# Altium schematic sheet Kasli-SOC_bank502_DDR.SchDoc: PS Bank 502
size 420 x 297 mm; CheckedBy: G.Kasprowicz; Author: F.Switakowski; CompanyName: WUT ISE; DrawnBy: F.Switakowski; Organization: WUT ISE; Address1: PW ISE; Address2: Nowowiejska 15/19 00-665 Warsaw; Address3: gkasprow@gmail.com; DocumentNumber: 4; Revision: 1; SheetNumber: 4; SheetTotal: 18; ModifiedBy: -; CheckedDate: -; Title2: DDR SDRAM; DivGrp: WUT ISE; Designer: G.Kasprowicz; ModifiedDate: -; ProjectName: Sensor Box
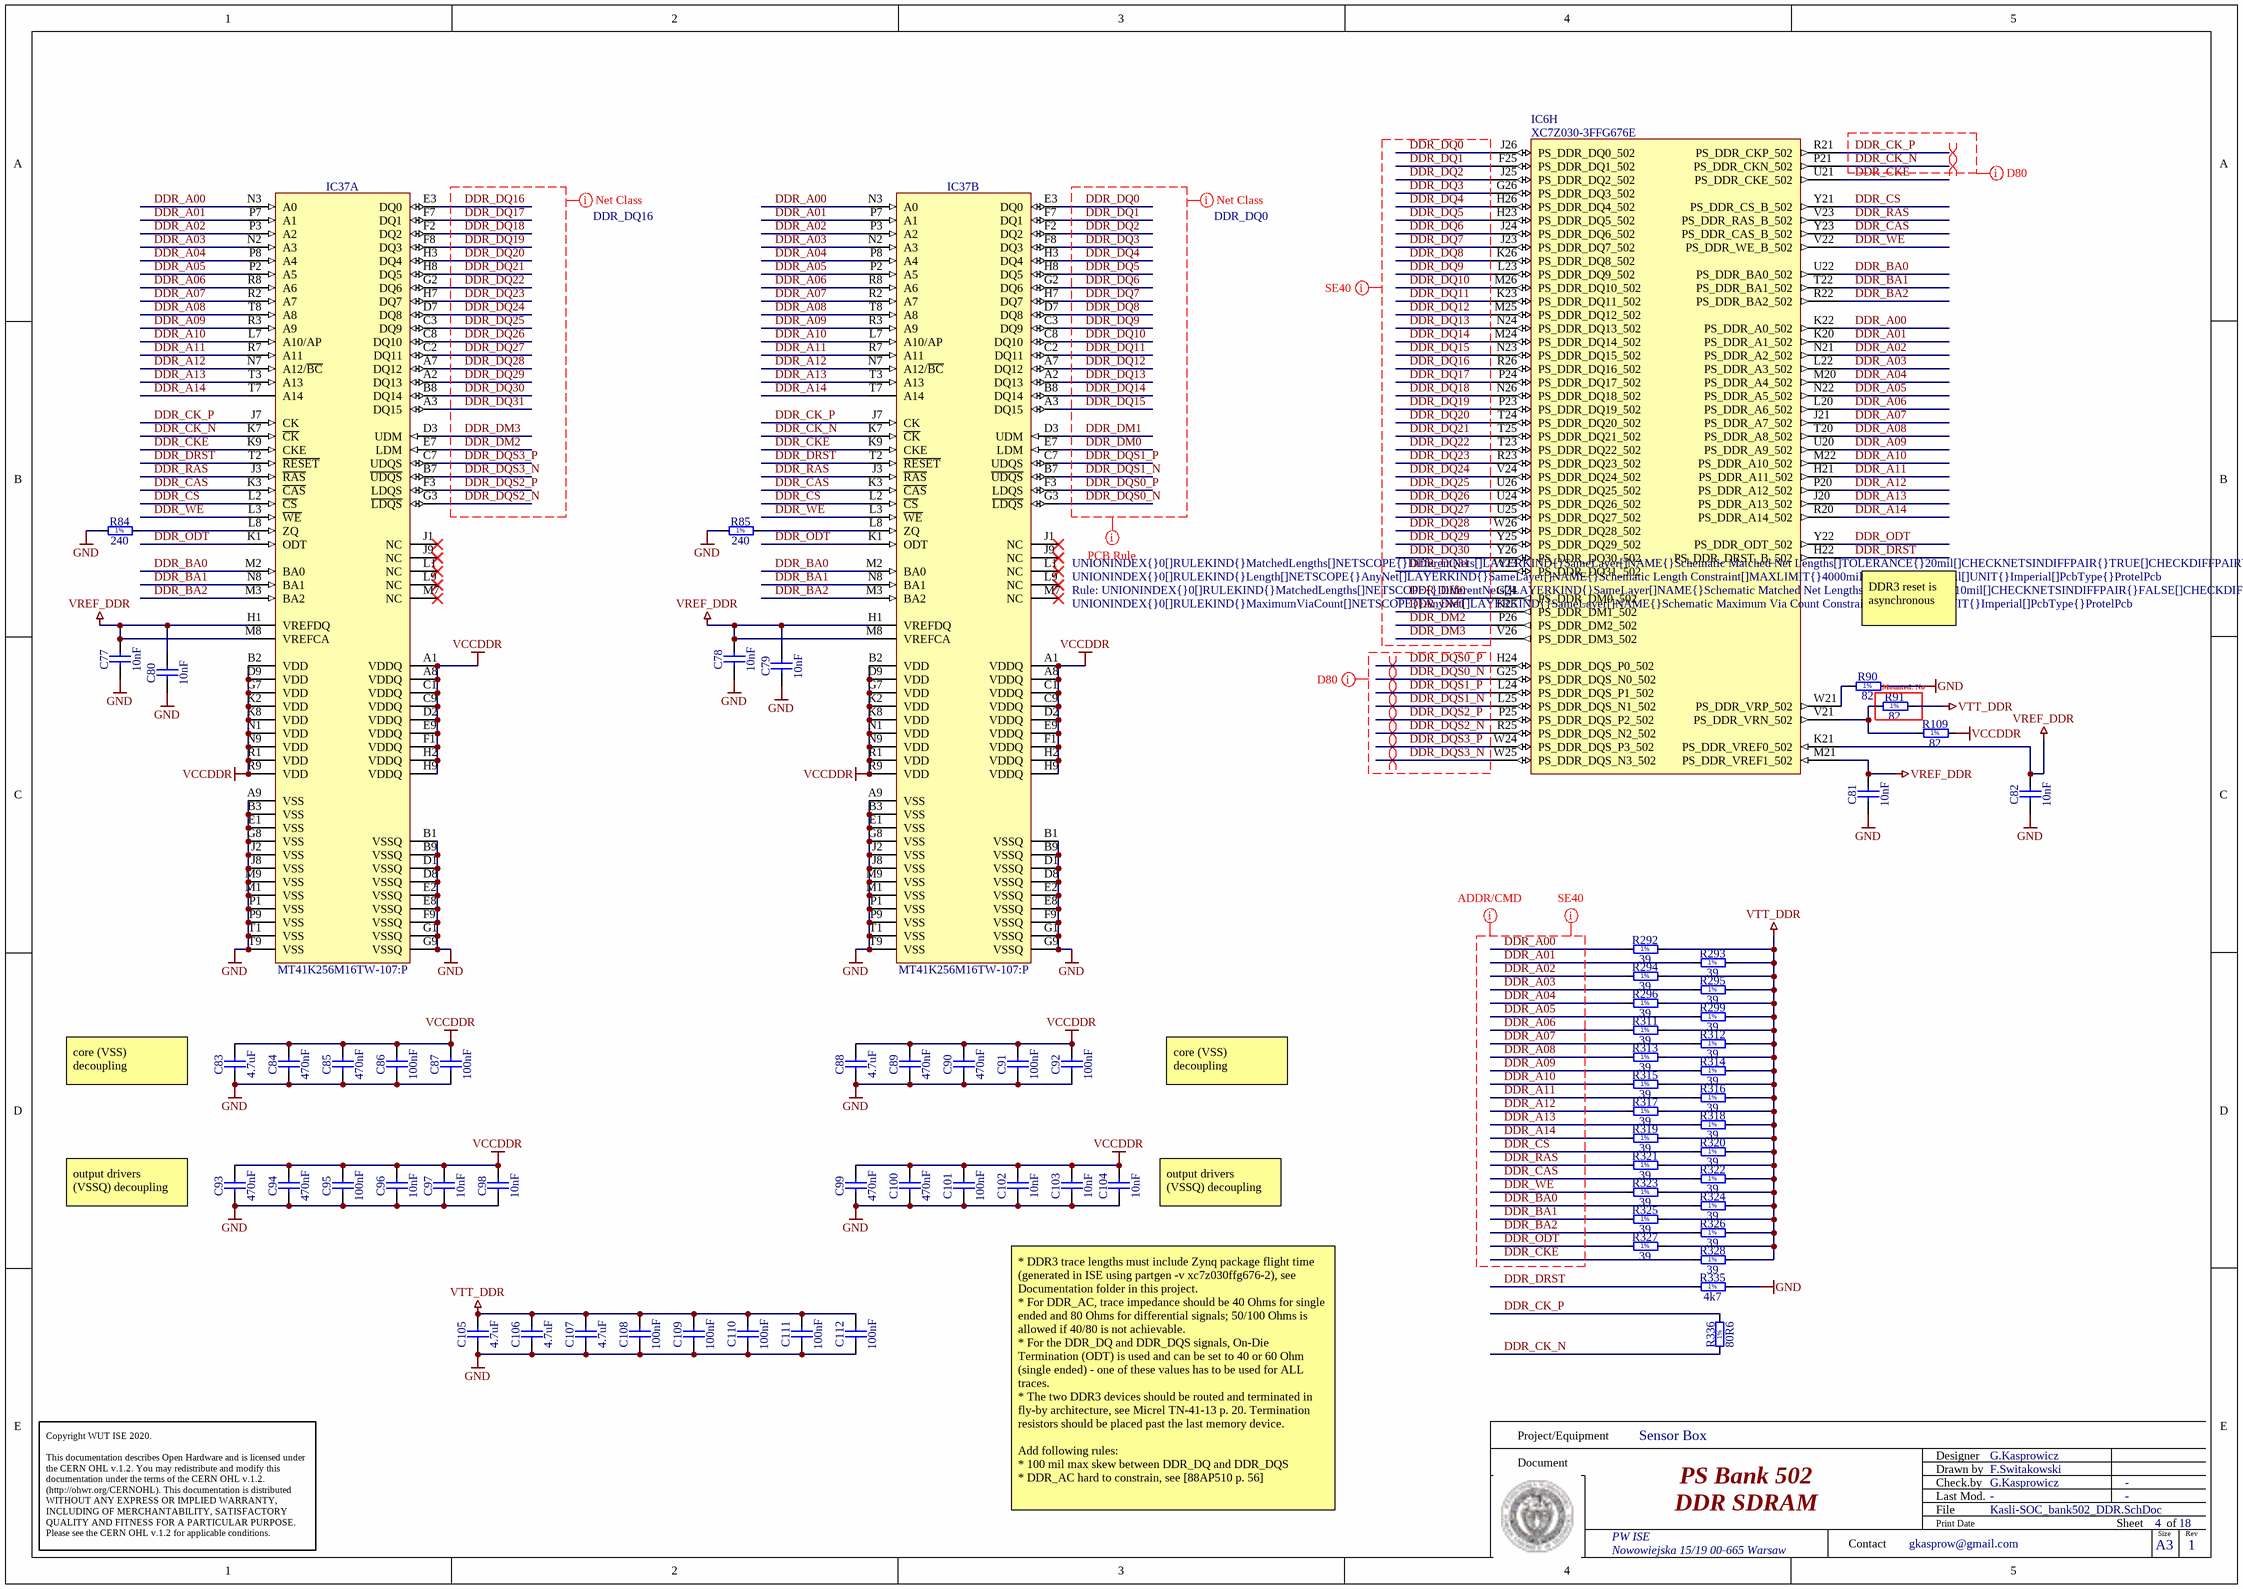
[diagram p0: Kasli-SOC_bank502_DDR.SchDoc]

## Parts
C77  10nF  [CAPC1005X55N]
C78  10nF  [CAPC1005X55N]
C79  10nF  [CAPC1005X55N]
C80  10nF  [CAPC1005X55N]
C81  10nF  [CAPC0603X33N]
C82  10nF  [CAPC0603X33N]
C83  4.7uF  [CAPC1005X55N]
C84  470nF  [CAPC1005X55N]
C85  470nF  [CAPC1005X55N]
C86  100nF  [CAPC1005X55N]
C87  100nF  [CAPC1005X55N]
C88  4.7uF  [CAPC1005X55N]
C89  470nF  [CAPC1005X55N]
C90  470nF  [CAPC1005X55N]
C91  100nF  [CAPC1005X55N]
C92  100nF  [CAPC1005X55N]
C93  470nF  [CAPC1005X55N]
C94  470nF  [CAPC1005X55N]
C95  100nF  [CAPC1005X55N]
C96  10nF  [CAPC1005X55N]
C97  10nF  [CAPC1005X55N]
C98  10nF  [CAPC1005X55N]
C99  470nF  [CAPC1005X55N]
C100  470nF  [CAPC1005X55N]
C101  100nF  [CAPC1005X55N]
C102  10nF  [CAPC1005X55N]
C103  10nF  [CAPC1005X55N]
C104  10nF  [CAPC1005X55N]
C105  4.7uF  [CAPC1005X55N]
C106  4.7uF  [CAPC1005X55N]
C107  4.7uF  [CAPC1005X55N]
C108  100nF  [CAPC1005X55N]
C109  100nF  [CAPC1005X55N]
C110  100nF  [CAPC1005X55N]
C111  100nF  [CAPC1005X55N]
C112  100nF  [CAPC1005X55N]
IC6  XC7Z030-3FFG676E  [BGA676C100P26X26_2700X2700X324]  (part H of 14)
IC37A  MT41K256M16TW-107:P  [BGA96C80P9X16_800X1400X120]
IC37B  MT41K256M16TW-107:P  [BGA96C80P9X16_800X1400X120]
R84  240  [RESC1005X40N]
R85  240  [RESC1005X40N]
R90  82  [RESC1005X40N]
R91  82  [RESC1005X40N]
R109  82  [RESC1005X40N]
R292  39  [RESC1005X40N]
R293  39  [RESC1005X40N]
R294  39  [RESC1005X40N]
R295  39  [RESC1005X40N]
R296  39  [RESC1005X40N]
R299  39  [RESC1005X40N]
R311  39  [RESC1005X40N]
R312  39  [RESC1005X40N]
R313  39  [RESC1005X40N]
R314  39  [RESC1005X40N]
R315  39  [RESC1005X40N]
R316  39  [RESC1005X40N]
R317  39  [RESC1005X40N]
R318  39  [RESC1005X40N]
R319  39  [RESC1005X40N]
R320  39  [RESC1005X40N]
R321  39  [RESC1005X40N]
R322  39  [RESC1005X40N]
R323  39  [RESC1005X40N]
R324  39  [RESC1005X40N]
R325  39  [RESC1005X40N]
R326  39  [RESC1005X40N]
R327  39  [RESC1005X40N]
R328  39  [RESC1005X40N]
R335  4k7  [RESC1005X40N]
R336  80R6  [RESC1005X40N]

## Nets
GND: C77.1 C78.1 C79.1 C80.1 C81.1 C82.1 C83.1 C84.1 C85.1 C86.1 C87.1 C88.1 C89.1 C90.1 C91.1 C92.1 C93.1 C94.1 C95.1 C96.1 C97.1 C98.1 C99.1 C100.1 C101.1 C102.1 C103.1 C104.1 C105.1 C106.1 C107.1 C108.1 C109.1 C110.1 C111.1 C112.1 IC37A.A9(VSS) IC37A.B1(VSSQ) IC37A.B3(VSS) IC37A.B9(VSSQ) IC37A.D1(VSSQ) IC37A.D8(VSSQ) IC37A.E1(VSS) IC37A.E2(VSSQ) IC37A.E8(VSSQ) IC37A.F9(VSSQ) IC37A.G1(VSSQ) IC37A.G8(VSS) IC37A.G9(VSSQ) IC37A.J2(VSS) IC37A.J8(VSS) IC37A.M1(VSS) IC37A.M9(VSS) IC37A.P1(VSS) IC37A.P9(VSS) IC37A.T1(VSS) IC37A.T9(VSS) IC37B.A9(VSS) IC37B.B1(VSSQ) IC37B.B3(VSS) IC37B.B9(VSSQ) IC37B.D1(VSSQ) IC37B.D8(VSSQ) IC37B.E1(VSS) IC37B.E2(VSSQ) IC37B.E8(VSSQ) IC37B.F9(VSSQ) IC37B.G1(VSSQ) IC37B.G8(VSS) IC37B.G9(VSSQ) IC37B.J2(VSS) IC37B.J8(VSS) IC37B.M1(VSS) IC37B.M9(VSS) IC37B.P1(VSS) IC37B.P9(VSS) IC37B.T1(VSS) IC37B.T9(VSS) R84.1 R85.1 R90.2 R335.2
VCCDDR: C83.2 C84.2 C85.2 C86.2 C87.2 C88.2 C89.2 C90.2 C91.2 C92.2 C93.2 C94.2 C95.2 C96.2 C97.2 C98.2 C99.2 C100.2 C101.2 C102.2 C103.2 C104.2 IC37A.A1(VDDQ) IC37A.A8(VDDQ) IC37A.B2(VDD) IC37A.C1(VDDQ) IC37A.C9(VDDQ) IC37A.D2(VDDQ) IC37A.D9(VDD) IC37A.E9(VDDQ) IC37A.F1(VDDQ) IC37A.G7(VDD) IC37A.H2(VDDQ) IC37A.H9(VDDQ) IC37A.K2(VDD) IC37A.K8(VDD) IC37A.N1(VDD) IC37A.N9(VDD) IC37A.R1(VDD) IC37A.R9(VDD) IC37B.A1(VDDQ) IC37B.A8(VDDQ) IC37B.B2(VDD) IC37B.C1(VDDQ) IC37B.C9(VDDQ) IC37B.D2(VDDQ) IC37B.D9(VDD) IC37B.E9(VDDQ) IC37B.F1(VDDQ) IC37B.G7(VDD) IC37B.H2(VDDQ) IC37B.H9(VDDQ) IC37B.K2(VDD) IC37B.K8(VDD) IC37B.N1(VDD) IC37B.N9(VDD) IC37B.R1(VDD) IC37B.R9(VDD) R109.2
VREF_DDR: C77.2 C78.2 C79.2 C80.2 C81.2 C82.2 IC6.K21(PS_DDR_VREF0_502) IC6.M21(PS_DDR_VREF1_502) IC37A.H1(VREFDQ) IC37A.M8(VREFCA) IC37B.H1(VREFDQ) IC37B.M8(VREFCA)
VTT_DDR: C105.2 C106.2 C107.2 C108.2 C109.2 C110.2 C111.2 C112.2 R91.2 R292.2 R293.2 R294.2 R295.2 R296.2 R299.2 R311.2 R312.2 R313.2 R314.2 R315.2 R316.2 R317.2 R318.2 R319.2 R320.2 R321.2 R322.2 R323.2 R324.2 R325.2 R326.2 R327.2 R328.2
DDR_A00: IC6.K22(PS_DDR_A0_502) IC37A.N3(A0) IC37B.N3(A0) R292.1
DDR_A01: IC6.K20(PS_DDR_A1_502) IC37A.P7(A1) IC37B.P7(A1) R293.1
DDR_A02: IC6.N21(PS_DDR_A2_502) IC37A.P3(A2) IC37B.P3(A2) R294.1
DDR_A03: IC6.L22(PS_DDR_A3_502) IC37A.N2(A3) IC37B.N2(A3) R295.1
DDR_A04: IC6.M20(PS_DDR_A4_502) IC37A.P8(A4) IC37B.P8(A4) R296.1
DDR_A05: IC6.N22(PS_DDR_A5_502) IC37A.P2(A5) IC37B.P2(A5) R299.1
DDR_A06: IC6.L20(PS_DDR_A6_502) IC37A.R8(A6) IC37B.R8(A6) R311.1
DDR_A07: IC6.J21(PS_DDR_A7_502) IC37A.R2(A7) IC37B.R2(A7) R312.1
DDR_A08: IC6.T20(PS_DDR_A8_502) IC37A.T8(A8) IC37B.T8(A8) R313.1
DDR_A09: IC6.U20(PS_DDR_A9_502) IC37A.R3(A9) IC37B.R3(A9) R314.1
DDR_A10: IC6.M22(PS_DDR_A10_502) IC37A.L7(A10/AP) IC37B.L7(A10/AP) R315.1
DDR_A11: IC6.H21(PS_DDR_A11_502) IC37A.R7(A11) IC37B.R7(A11) R316.1
DDR_A12: IC6.P20(PS_DDR_A12_502) IC37A.N7(A12/~{BC}) IC37B.N7(A12/~{BC}) R317.1
DDR_A13: IC6.J20(PS_DDR_A13_502) IC37A.T3(A13) IC37B.T3(A13) R318.1
DDR_A14: IC6.R20(PS_DDR_A14_502) IC37A.T7(A14) IC37B.T7(A14) R319.1
DDR_BA0: IC6.U22(PS_DDR_BA0_502) IC37A.M2(BA0) IC37B.M2(BA0) R324.1
DDR_BA1: IC6.T22(PS_DDR_BA1_502) IC37A.N8(BA1) IC37B.N8(BA1) R325.1
DDR_BA2: IC6.R22(PS_DDR_BA2_502) IC37A.M3(BA2) IC37B.M3(BA2) R326.1
DDR_CAS: IC6.Y23(PS_DDR_CAS_B_502) IC37A.K3(~{CAS}) IC37B.K3(~{CAS}) R322.1
DDR_CK_N: IC6.P21(PS_DDR_CKN_502) IC37A.K7(~{CK}) IC37B.K7(~{CK}) R336.1
DDR_CK_P: IC6.R21(PS_DDR_CKP_502) IC37A.J7(CK) IC37B.J7(CK) R336.2
DDR_CKE: IC6.U21(PS_DDR_CKE_502) IC37A.K9(CKE) IC37B.K9(CKE) R328.1
DDR_CS: IC6.Y21(PS_DDR_CS_B_502) IC37A.L2(~{CS}) IC37B.L2(~{CS}) R320.1
DDR_DM0: IC6.G24(PS_DDR_DM0_502) IC37B.E7(LDM)
DDR_DM1: IC6.K25(PS_DDR_DM1_502) IC37B.D3(UDM)
DDR_DM2: IC6.P26(PS_DDR_DM2_502) IC37A.E7(LDM)
DDR_DM3: IC6.V26(PS_DDR_DM3_502) IC37A.D3(UDM)
DDR_DQ0: IC6.J26(PS_DDR_DQ0_502) IC37B.E3(DQ0)
DDR_DQ1: IC6.F25(PS_DDR_DQ1_502) IC37B.F7(DQ1)
DDR_DQ2: IC6.J25(PS_DDR_DQ2_502) IC37B.F2(DQ2)
DDR_DQ3: IC6.G26(PS_DDR_DQ3_502) IC37B.F8(DQ3)
DDR_DQ4: IC6.H26(PS_DDR_DQ4_502) IC37B.H3(DQ4)
DDR_DQ5: IC6.H23(PS_DDR_DQ5_502) IC37B.H8(DQ5)
DDR_DQ6: IC6.J24(PS_DDR_DQ6_502) IC37B.G2(DQ6)
DDR_DQ7: IC6.J23(PS_DDR_DQ7_502) IC37B.H7(DQ7)
DDR_DQ8: IC6.K26(PS_DDR_DQ8_502) IC37B.D7(DQ8)
DDR_DQ9: IC6.L23(PS_DDR_DQ9_502) IC37B.C3(DQ9)
DDR_DQ10: IC6.M26(PS_DDR_DQ10_502) IC37B.C8(DQ10)
DDR_DQ11: IC6.K23(PS_DDR_DQ11_502) IC37B.C2(DQ11)
DDR_DQ12: IC6.M25(PS_DDR_DQ12_502) IC37B.A7(DQ12)
DDR_DQ13: IC6.N24(PS_DDR_DQ13_502) IC37B.A2(DQ13)
DDR_DQ14: IC6.M24(PS_DDR_DQ14_502) IC37B.B8(DQ14)
DDR_DQ15: IC6.N23(PS_DDR_DQ15_502) IC37B.A3(DQ15)
DDR_DQ16: IC6.R26(PS_DDR_DQ16_502) IC37A.E3(DQ0)
DDR_DQ17: IC6.P24(PS_DDR_DQ17_502) IC37A.F7(DQ1)
DDR_DQ18: IC6.N26(PS_DDR_DQ18_502) IC37A.F2(DQ2)
DDR_DQ19: IC6.P23(PS_DDR_DQ19_502) IC37A.F8(DQ3)
DDR_DQ20: IC6.T24(PS_DDR_DQ20_502) IC37A.H3(DQ4)
DDR_DQ21: IC6.T25(PS_DDR_DQ21_502) IC37A.H8(DQ5)
DDR_DQ22: IC6.T23(PS_DDR_DQ22_502) IC37A.G2(DQ6)
DDR_DQ23: IC6.R23(PS_DDR_DQ23_502) IC37A.H7(DQ7)
DDR_DQ24: IC6.V24(PS_DDR_DQ24_502) IC37A.D7(DQ8)
DDR_DQ25: IC6.U26(PS_DDR_DQ25_502) IC37A.C3(DQ9)
DDR_DQ26: IC6.U24(PS_DDR_DQ26_502) IC37A.C8(DQ10)
DDR_DQ27: IC6.U25(PS_DDR_DQ27_502) IC37A.C2(DQ11)
DDR_DQ28: IC6.W26(PS_DDR_DQ28_502) IC37A.A7(DQ12)
DDR_DQ29: IC6.Y25(PS_DDR_DQ29_502) IC37A.A2(DQ13)
DDR_DQ30: IC6.Y26(PS_DDR_DQ30_502) IC37A.B8(DQ14)
DDR_DQ31: IC6.W23(PS_DDR_DQ31_502) IC37A.A3(DQ15)
DDR_DQS0_N: IC6.G25(PS_DDR_DQS_N0_502) IC37B.G3(~{LDQS})
DDR_DQS0_P: IC6.H24(PS_DDR_DQS_P0_502) IC37B.F3(LDQS)
DDR_DQS1_N: IC6.L25(PS_DDR_DQS_N1_502) IC37B.B7(~{UDQS})
DDR_DQS1_P: IC6.L24(PS_DDR_DQS_P1_502) IC37B.C7(UDQS)
DDR_DQS2_N: IC6.R25(PS_DDR_DQS_N2_502) IC37A.G3(~{LDQS})
DDR_DQS2_P: IC6.P25(PS_DDR_DQS_P2_502) IC37A.F3(LDQS)
DDR_DQS3_N: IC6.W25(PS_DDR_DQS_N3_502) IC37A.B7(~{UDQS})
DDR_DQS3_P: IC6.W24(PS_DDR_DQS_P3_502) IC37A.C7(UDQS)
DDR_DRST: IC6.H22(PS_DDR_DRST_B_502) IC37A.T2(~{RESET}) IC37B.T2(~{RESET}) R335.1
DDR_ODT: IC6.Y22(PS_DDR_ODT_502) IC37A.K1(ODT) IC37B.K1(ODT) R327.1
DDR_RAS: IC6.V23(PS_DDR_RAS_B_502) IC37A.J3(~{RAS}) IC37B.J3(~{RAS}) R321.1
DDR_WE: IC6.V22(PS_DDR_WE_B_502) IC37A.L3(~{WE}) IC37B.L3(~{WE}) R323.1
NetIC6_V21: IC6.V21(PS_DDR_VRN_502) R91.1 R109.1
NetIC6_W21: IC6.W21(PS_DDR_VRP_502) R90.1
NetIC37A_L8: IC37A.L8(ZQ) R84.2
NetIC37B_L8: IC37B.L8(ZQ) R85.2

Not connected (* = marked no-connect by the designer): IC37A J1(NC)* J9(NC)* L1(NC)* L9(NC)* M7(NC)*; IC37B J1(NC)* J9(NC)* L1(NC)* L9(NC)* M7(NC)*

## Layout directives
differential pair: DDR_CK_N, DDR_CK_P, DDR_DQS0_N, DDR_DQS0_P, DDR_DQS1_N, DDR_DQS1_P, DDR_DQS2_N, DDR_DQS2_P, DDR_DQS3_N, DDR_DQS3_P
net class DDR_DQ0: DDR_DM0, DDR_DM1, DDR_DQ0, DDR_DQ1, DDR_DQ2, DDR_DQ3, DDR_DQ4, DDR_DQ5, DDR_DQ6, DDR_DQ7, DDR_DQ8, DDR_DQ9, DDR_DQ10, DDR_DQ11, DDR_DQ12, DDR_DQ13, DDR_DQ14, DDR_DQ15, DDR_DQS0_N, DDR_DQS0_P, DDR_DQS1_N, DDR_DQS1_P
rule Matched Net Lengths [Tolerance = 10mil]; rule Maximum Via Count Constraint [Max Count = 2]; rule Length Constraint [Min Length = 0mil    Max Length = 4000mil]; rule Clearance Constraint [Generic clearance = 4mil, and 1 value(s) for objects]; rule Matched Net Lengths [Tolerance = 20mil]: DDR_DM0, DDR_DM1, DDR_DQ0, DDR_DQ1, DDR_DQ2, DDR_DQ3, DDR_DQ4, DDR_DQ5, DDR_DQ6, DDR_DQ7, DDR_DQ8, DDR_DQ9, DDR_DQ10, DDR_DQ11, DDR_DQ12, DDR_DQ13, DDR_DQ14, DDR_DQ15, DDR_DQS0_N, DDR_DQS0_P, DDR_DQS1_N, DDR_DQS1_P
net class DDR_DQ16: DDR_DM2, DDR_DM3, DDR_DQ16, DDR_DQ17, DDR_DQ18, DDR_DQ19, DDR_DQ20, DDR_DQ21, DDR_DQ22, DDR_DQ23, DDR_DQ24, DDR_DQ25, DDR_DQ26, DDR_DQ27, DDR_DQ28, DDR_DQ29, DDR_DQ30, DDR_DQ31, DDR_DQS2_N, DDR_DQS2_P, DDR_DQS3_N, DDR_DQS3_P
net class SE40: DDR_A00, DDR_A01, DDR_A02, DDR_A03, DDR_A04, DDR_A05, DDR_A06, DDR_A07, DDR_A08, DDR_A09, DDR_A10, DDR_A11, DDR_A12, DDR_A13, DDR_A14, DDR_BA0, DDR_BA1, DDR_BA2, DDR_CAS, DDR_CKE, DDR_CS, DDR_DM0, DDR_DM1, DDR_DM2, DDR_DM3, DDR_DQ0, DDR_DQ1, DDR_DQ2, DDR_DQ3, DDR_DQ4, DDR_DQ5, DDR_DQ6, DDR_DQ7, DDR_DQ8, DDR_DQ9, DDR_DQ10, DDR_DQ11, DDR_DQ12, DDR_DQ13, DDR_DQ14, DDR_DQ15, DDR_DQ16, DDR_DQ17, DDR_DQ18, DDR_DQ19, DDR_DQ20, DDR_DQ21, DDR_DQ22, DDR_DQ23, DDR_DQ24, DDR_DQ25, DDR_DQ26, DDR_DQ27, DDR_DQ28, DDR_DQ29, DDR_DQ30, DDR_DQ31, DDR_ODT, DDR_RAS, DDR_WE
net class ADDR/CMD: DDR_A00, DDR_A01, DDR_A02, DDR_A03, DDR_A04, DDR_A05, DDR_A06, DDR_A07, DDR_A08, DDR_A09, DDR_A10, DDR_A11, DDR_A12, DDR_A13, DDR_A14, DDR_BA0, DDR_BA1, DDR_BA2, DDR_CAS, DDR_CKE, DDR_CS, DDR_ODT, DDR_RAS, DDR_WE
net class D80: DDR_CK_N, DDR_CK_P, DDR_DQS0_N, DDR_DQS0_P, DDR_DQS1_N, DDR_DQS1_P, DDR_DQS2_N, DDR_DQS2_P, DDR_DQS3_N, DDR_DQS3_P

## Notes on the sheet
- DDR3 reset is asynchronous
- (near R90) Mounted: No
- (near C83) core (VSS) decoupling
- core (VSS) decoupling
- (near C93) output drivers (VSSQ) decoupling
- (near C104) output drivers (VSSQ) decoupling
- * DDR3 trace lengths must include Zynq package flight time (generated in ISE using partgen -v xc7z030ffg676-2), see Documentation folder in this project.
  * For DDR_AC, trace impedance should be 40 Ohms for single ended and 80 Ohms for differential signals; 50/100 Ohms is allowed if 40/80 is not achievable.
  * For the DDR_DQ and DDR_DQS signals, On-Die Termination (ODT) is used and can be set to 40 or 60 Ohm (single ended) - one of these values has to be used for ALL traces.
  * The two DDR3 devices should be routed and terminated in fly-by architecture, see Micrel TN-41-13 p. 20. Termination resistors should be placed past the last memory device.
  Add following rules:
  * 100 mil max skew between DDR_DQ and DDR_DQS
  * DDR_AC hard to constrain, see [88AP510 p. 56]
- Project/Equipment
- Document
- Designer
- Drawn by
- Check.by
- Copyright WUT ISE 2020.
  This documentation describes Open Hardware and is licensed under the CERN OHL v.1.2. You may redistribute and modify this documentation under the terms of the CERN OHL v.1.2. (http://ohwr.org/CERNOHL). This documentation is distributed WITHOUT ANY EXPRESS OR IMPLIED WARRANTY, INCLUDING OF MERCHANTABILITY, SATISFACTORY QUALITY AND FITNESS FOR A PARTICULAR PURPOSE. Please see the CERN OHL v.1.2 for applicable conditions.
- Contact
- File
- Last Mod.
- Print Date
- Sheet
- Size
- A3
- of
- Rev
- (in symbol R0402_4K7_1%_0.0625W_100PPM) 1%
- (in symbol R0402_39R_1%_0.0625W_100PPM) 1%
- (in symbol R0402_80R6_1%_0.1W_100PPM) 1%
- (in symbol R0402_82R_1%_0.0625W_100PPM) 1%
- (in symbol R0402_240R_1%_0.0625W_100PPM) 1%

## Library data of the parts
C77-C80 C96-C98 C102-C104 = CC0402_10NF_16V_10%_X7R: Non-polarised capacitor; Part Description: SMD Multilayer Chip Ceramic Capacitor; Manufacturer: GENERIC; Manufacturer1 Part Number: 223878715636; Voltage: 16V; TC: X7R; Tolerance: ±10%; Part Number: CC0402_10NF_16V_10%_X7R; Component Kind: Standard; Component Type: Standard; Pin Count: 2; Value: 10nF; Status: Not Recommended; Manufacturer Part Number: CC0402_10NF_16V_10%_X7R; Case: 0402; Mounted: Yes; Socket: No; SMD: Yes; Sense: No; Manufacturer1 Example: PHYCOMP; Manufacturer1 ComponentHeight: 0.55mm; HelpURL: \\cern.ch\dfs\Applications\Altium\Datasheets\CC0402_X7R_PHYCOMP.pdf; Author: CERN DEM JLC; CreateDate: 03.12.2007; LatestRevisionDate: 03.12.2007
C81 C82 = CC0201_10NF_10V_10%_X5R: Non-polarised capacitor; Part Description: SMD Multilayer Chip Ceramic Capacitor; Manufacturer: GENERIC; Manufacturer1 Part Number: 0201ZD103KAT2A; Voltage: 10V; TC: X5R; Tolerance: ±10%; Part Number: CC0201_10NF_10V_10%_X5R; Component Kind: Standard; Component Type: Standard; Pin Count: 2; Value: 10nF; Status: Not Recommended; Manufacturer Part Number: CC0201_10NF_10V_10%_X5R; Case: 0201; Mounted: Yes; Socket: No; SMD: Yes; Sense: No; Manufacturer1 Example: AVX; Manufacturer1 ComponentHeight: 0.33mm; HelpURL: \\cern.ch\dfs\Applications\Altium\Datasheets\CC0201_X5R_AVX.pdf; Author: CERN DEM JLC; CreateDate: 03.12.2007; LatestRevisionDate: 03.12.2007
C83 C88 C105-C107 = CC0402_4.7UF_6.3V_20%_X5R: Non-polarised capacitor; Part Description: SMD Multilayer Chip Ceramic Capacitor; Manufacturer: GENERIC; Manufacturer1 Part Number: C1005X5R0J475M050BC; Voltage: 6.3V; TC: X5R; Tolerance: ±20%; Part Number: CC0402_4.7UF_6.3V_20%_X5R; Component Kind: Standard; Component Type: Standard; Pin Count: 2; Value: 4.7uF; Status: Preferred; Manufacturer Part Number: CC0402_4.7UF_6.3V_20%_X5R; Case: 0402; Mounted: Yes; Socket: No; SMD: Yes; Sense: No; Manufacturer1 Example: TDK; Manufacturer1 ComponentHeight: 0.65mm; HelpURL: \\cern.ch\dfs\Applications\Altium\Datasheets\CC0402_X5R_TDK_C.pdf; Author: CERN DEM JLC; CreateDate: 03/03/2015; LatestRevisionDate: 03/03/2015
C84 C85 C89 C90 C93 C94 C99 C100 = CC0402_470NF_16V_10%_X5R: Non-polarised capacitor; Part Description: SMD Multilayer Chip Ceramic Capacitor; Manufacturer: GENERIC; Manufacturer1 Part Number: C1005X5R1C105KT; Voltage: 16V; TC: X5R; Tolerance: ±10%; Part Number: CC0402_470NF_16V_10%_X5R; Component Kind: Standard; Component Type: Standard; Pin Count: 2; Value: 470nF; Status: Preferred; Manufacturer Part Number: CC0402_470NF_16V_10%_X5R; Case: 0402; Mounted: Yes; Socket: No; SMD: Yes; Sense: No; Manufacturer1 Example: TDK; Manufacturer1 ComponentHeight: 0.55mm; HelpURL: \\cern.ch\dfs\Applications\Altium\Datasheets\CC0402_X5R_TDK_C.pdf; Author: CERN DEM JLC; CreateDate: 10/25/2012; LatestRevisionDate: 10/25/2012
C86 C87 C91 C92 C95 C101 C108-C112 = CC0402_100NF_16V_10%_X7R: Non-polarised capacitor; Part Description: SMD Multilayer Chip Ceramic Capacitor; Manufacturer: GENERIC; Manufacturer1 Part Number: GRM155R71C104KA88D; Voltage: 16V; TC: X7R; Tolerance: ±10%; Part Number: CC0402_100NF_16V_10%_X7R; Component Kind: Standard; Component Type: Standard; Pin Count: 2; Value: 100nF; Status: Not Recommended; Manufacturer Part Number: CC0402_100NF_16V_10%_X7R; Case: 0402; Mounted: Yes; Socket: No; SMD: Yes; Sense: No; Manufacturer1 Example: MURATA; Manufacturer1 ComponentHeight: 0.55mm; HelpURL: \\cern.ch\dfs\Applications\Altium\Datasheets\CC0402_X7R_MURATA_GRM.pdf; Author: CERN DEM JLC; CreateDate: 05/12/2013; LatestRevisionDate: 03/12/2007
IC6 = XC7Z030-2FFG676I: 733 MHz Zynq™-7000 AP SoC, 130 PS I/O, 254 FPGA I/O, 676-Ball BGA, Speed Grade 2, Industrial Grade, Pb-Free; Part Description: Zynq™-7000 All Programmable SoC, Dual-core ARM® Cortex™-A9 CPU, 676-Ball BGA, Speed Grade 2, Industrial Grade, Pb-Free; Manufacturer: XILINX; PressFit: No; Bonding: No; Part Number: XC7Z030-3FFG676E; Component Kind: Standard; Component Type: Standard; Device: XC7Z030-2FFG676I; PackageDescription: BGA, 1.00mm Pitch, Square; 676 Pin, 26 Columns X 26 Rows, 27.00mm X 27.00mm X 2.60mm H; Manufacturer Part Number: XC7Z030-3FFG676E; Pin Count: 676; Case: BGA676; Mounted: Yes; Socket: No; SMD: Yes; Sense: No; ComponentHeight: 3.24mm; HelpURL: \\cern.ch\dfs\Applications\Altium\Datasheets\XC7Z030-2FFG676I.pdf; ComponentLink1URL: \\cern.ch\dfs\Applications\Altium\Datasheets\XC7Z030-2FFG676I_Package.pdf; ComponentLink1Description: Package; ComponentLink2URL: \\cern.ch\dfs\Applications\Altium\Datasheets\XC7Z030-2FFG676I_Pinout.txt; ComponentLink2Description: Pinout; Author: CERN DEM JLC; CreateDate: 29/04/2014; LatestRevisionDate: 29/04/2014
IC37A IC37B = MT41K256M16TW-107:P: 32 Meg x 16 x 8 Banks DDR3L SDRAM; Part Description: +1.5V, 4Gb (32Meg x 16 x 8 banks) DDR3L SDRAM; Manufacturer: MICRON TECHNOLOGY; PressFit: No; Bonding: No; Part Number: MT41K256M16TW-107:P; Component Kind: Standard; Component Type: Standard; Device: MT41K256M16TW-107:P; PackageDescription: BGA, 0.80mm Pitch, Rect.; 96 Pin, 9 Columns X 16 Rows, Body 14.00mm X 8.00mm X 1.20mm H; Manufacturer Part Number: MT41K256M16TW-107:P; Pin Count: 96; Case: BGA96; Mounted: Yes; Socket: No; SMD: Yes; Sense: No; ComponentHeight: 1.2mm; HelpURL: \\cern.ch\dfs\Applications\Altium\Datasheets\MT41K256M16TW-107-P.pdf; Author: CERN DEM MR; CreateDate: 14.12.2015; LatestRevisionDate: 14.12.2015
R84 R85 = R0402_240R_1%_0.0625W_100PPM: Resistor - 1%; Part Description: General Purpose Thick Film Chip Resistor; Manufacturer: GENERIC; Manufacturer1 Part Number: 232270672401L; TC: ±100ppm/°C; PressFit: No; Part Number: R0402_240R_1%_0.0625W_100PPM; Component Kind: Standard; Component Type: Standard; Pin Count: 2; Value: 240; Status: Not Recommended; Power: 0.0625W; Tolerance: ±1%; Manufacturer Part Number: R0402_240R_1%_0.0625W_100PPM; Case: 0402; Mounted: Yes; Sense: No; Socket: No; SMD: Yes; Manufacturer1 Example: YAGEO PHYCOMP; Manufacturer1 ComponentHeight: 0.4mm; HelpURL: \\cern.ch\dfs\Applications\Altium\Datasheets\R0402_Phycomp_RC0402.pdf; Author: CERN DEM JLC; CreateDate: 12/3/2007; LatestRevisionDate: 10/17/2012
R90 R109 = R0402_82R_1%_0.0625W_100PPM: Resistor - 1%; Part Description: General Purpose Thick Film Chip Resistor; Manufacturer: GENERIC; Manufacturer1 Part Number: 232270678209L; TC: ±100ppm/°C; PressFit: No; Part Number: R0402_82R_1%_0.0625W_100PPM; Component Kind: Standard; Component Type: Standard; Pin Count: 2; Value: 82; Status: Not Recommended; Power: 0.0625W; Tolerance: ±1%; Manufacturer Part Number: R0402_82R_1%_0.0625W_100PPM; Case: 0402; Mounted: Yes; Sense: No; Socket: No; SMD: Yes; Manufacturer1 Example: YAGEO PHYCOMP; Manufacturer1 ComponentHeight: 0.4mm; HelpURL: \\cern.ch\dfs\Applications\Altium\Datasheets\R0402_Phycomp_RC0402.pdf; Author: CERN DEM JLC; CreateDate: 03.12.2007; LatestRevisionDate: 17.10.2012
R91 = R0402_82R_1%_0.0625W_100PPM: Resistor - 1%; Part Description: General Purpose Thick Film Chip Resistor; Manufacturer: GENERIC; Manufacturer1 Part Number: 232270678209L; TC: ±100ppm/°C; PressFit: No; Mounted: No; Part Number: R0402_82R_1%_0.0625W_100PPM; Component Kind: Standard; Component Type: Standard; Pin Count: 2; Value: 82; Status: Not Recommended; Power: 0.0625W; Tolerance: ±1%; Manufacturer Part Number: R0402_82R_1%_0.0625W_100PPM; Case: 0402; Sense: No; Socket: No; SMD: Yes; Manufacturer1 Example: YAGEO PHYCOMP; Manufacturer1 ComponentHeight: 0.4mm; HelpURL: \\cern.ch\dfs\Applications\Altium\Datasheets\R0402_Phycomp_RC0402.pdf; Author: CERN DEM JLC; CreateDate: 03.12.2007; LatestRevisionDate: 17.10.2012
R292-R296 R299 R311-R328 = R0402_39R_1%_0.0625W_100PPM: Resistor - 1%; Part Description: General Purpose Thick Film Chip Resistor; Manufacturer: GENERIC; Manufacturer1 Part Number: 232270673909L; TC: ±100ppm/°C; PressFit: No; Part Number: R0402_39R_1%_0.0625W_100PPM; Component Kind: Standard; Component Type: Standard; Pin Count: 2; Value: 39; Status: Not Recommended; Power: 0.0625W; Tolerance: ±1%; Manufacturer Part Number: R0402_39R_1%_0.0625W_100PPM; Case: 0402; Mounted: Yes; Sense: No; Socket: No; SMD: Yes; Manufacturer1 Example: YAGEO PHYCOMP; Manufacturer1 ComponentHeight: 0.4mm; HelpURL: \\cern.ch\dfs\Applications\Altium\Datasheets\R0402_Phycomp_RC0402.pdf; Author: CERN DEM JLC; CreateDate: 03.12.2007; LatestRevisionDate: 17.10.2012
R335 = R0402_4K7_1%_0.0625W_100PPM: Resistor - 1%; Part Description: General Purpose Thick Film Chip Resistor; Manufacturer: GENERIC; Manufacturer1 Part Number: 232270674702L; TC: ±100ppm/°C; PressFit: No; Part Number: R0402_4K7_1%_0.0625W_100PPM; Component Kind: Standard; Component Type: Standard; Pin Count: 2; Value: 4k7; Status: Not Recommended; Power: 0.0625W; Tolerance: ±1%; Manufacturer Part Number: R0402_4K7_1%_0.0625W_100PPM; Case: 0402; Mounted: Yes; Sense: No; Socket: No; SMD: Yes; Manufacturer1 Example: YAGEO PHYCOMP; Manufacturer1 ComponentHeight: 0.4mm; HelpURL: \\cern.ch\dfs\Applications\Altium\Datasheets\R0402_Phycomp_RC0402.pdf; Author: CERN DEM JLC; CreateDate: 03.12.2007; LatestRevisionDate: 17.10.2012
R336 = R0402_80R6_1%_0.1W_100PPM: Resistor - 1%; Part Description: General Purpose Thick Film Chip Resistor; Manufacturer: GENERIC; Manufacturer1 Part Number: ERJ2RKF80R6X; Power: 0.1W; TC: ±100ppm/°C; Voltage: 50V; PressFit: No; Part Number: R0402_80R6_1%_0.1W_100PPM; Component Kind: Standard; Component Type: Standard; Pin Count: 2; Value: 80R6; Status: Not Recommended; Tolerance: ±1%; Manufacturer Part Number: R0402_80R6_1%_0.1W_100PPM; Case: 0402; Mounted: Yes; Sense: No; Socket: No; SMD: Yes; Manufacturer1 Example: PANASONIC; Manufacturer1 ComponentHeight: 0.4mm; HelpURL: \\cern.ch\dfs\Applications\Altium\Datasheets\R0402_PANASONIC_ERJ2RK.pdf; Author: CERN DEM JLC; CreateDate: 3/3/2015; LatestRevisionDate: 3/3/2015